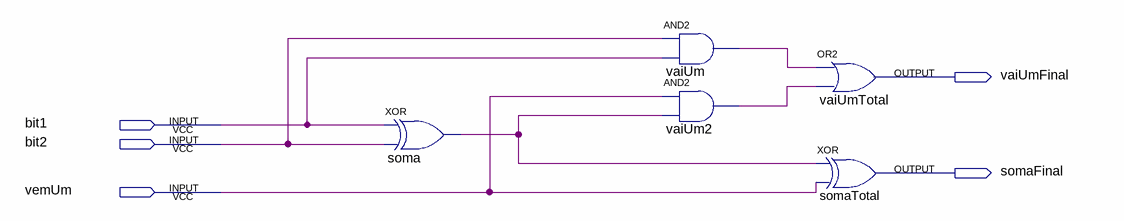
[diagram p0: schematic sheet]
// Quartus schematic SomaUmBit.bdf as structural Verilog: 5 symbols, 5 pins
module SomaUmBit (
  input  bit1,
  input  bit2,
  input  vemUm,
  output vaiUmFinal,
  output somaFinal
);

  wire soma_out, vaiUm2_out, vaiUm_out;

  xor soma (soma_out, bit1, bit2);
  and vaiUm (vaiUm_out, bit2, bit1);
  and vaiUm2 (vaiUm2_out, vemUm, soma_out);
  or vaiUmTotal (vaiUmFinal, vaiUm_out, vaiUm2_out);
  xor somaTotal (somaFinal, soma_out, vemUm);
endmodule
